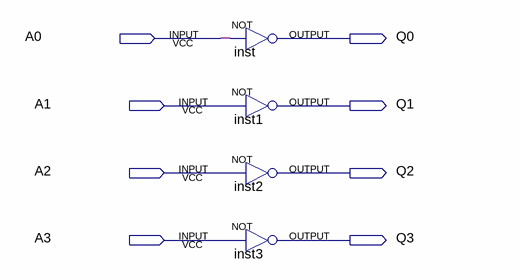
[diagram p0: schematic sheet]
// Quartus schematic not4bits.bdf as structural Verilog: 4 symbols, 8 pins
module not4bits (
  input  A0,
  input  A1,
  input  A2,
  input  A3,
  output Q0,
  output Q1,
  output Q2,
  output Q3
);

  not inst (Q0, A0);
  not inst1 (Q1, A1);
  not inst2 (Q2, A2);
  not inst3 (Q3, A3);
endmodule
